# Altium schematic sheet main.SchDoc
size A4; SheetNumber: 1; SheetTotal: 1
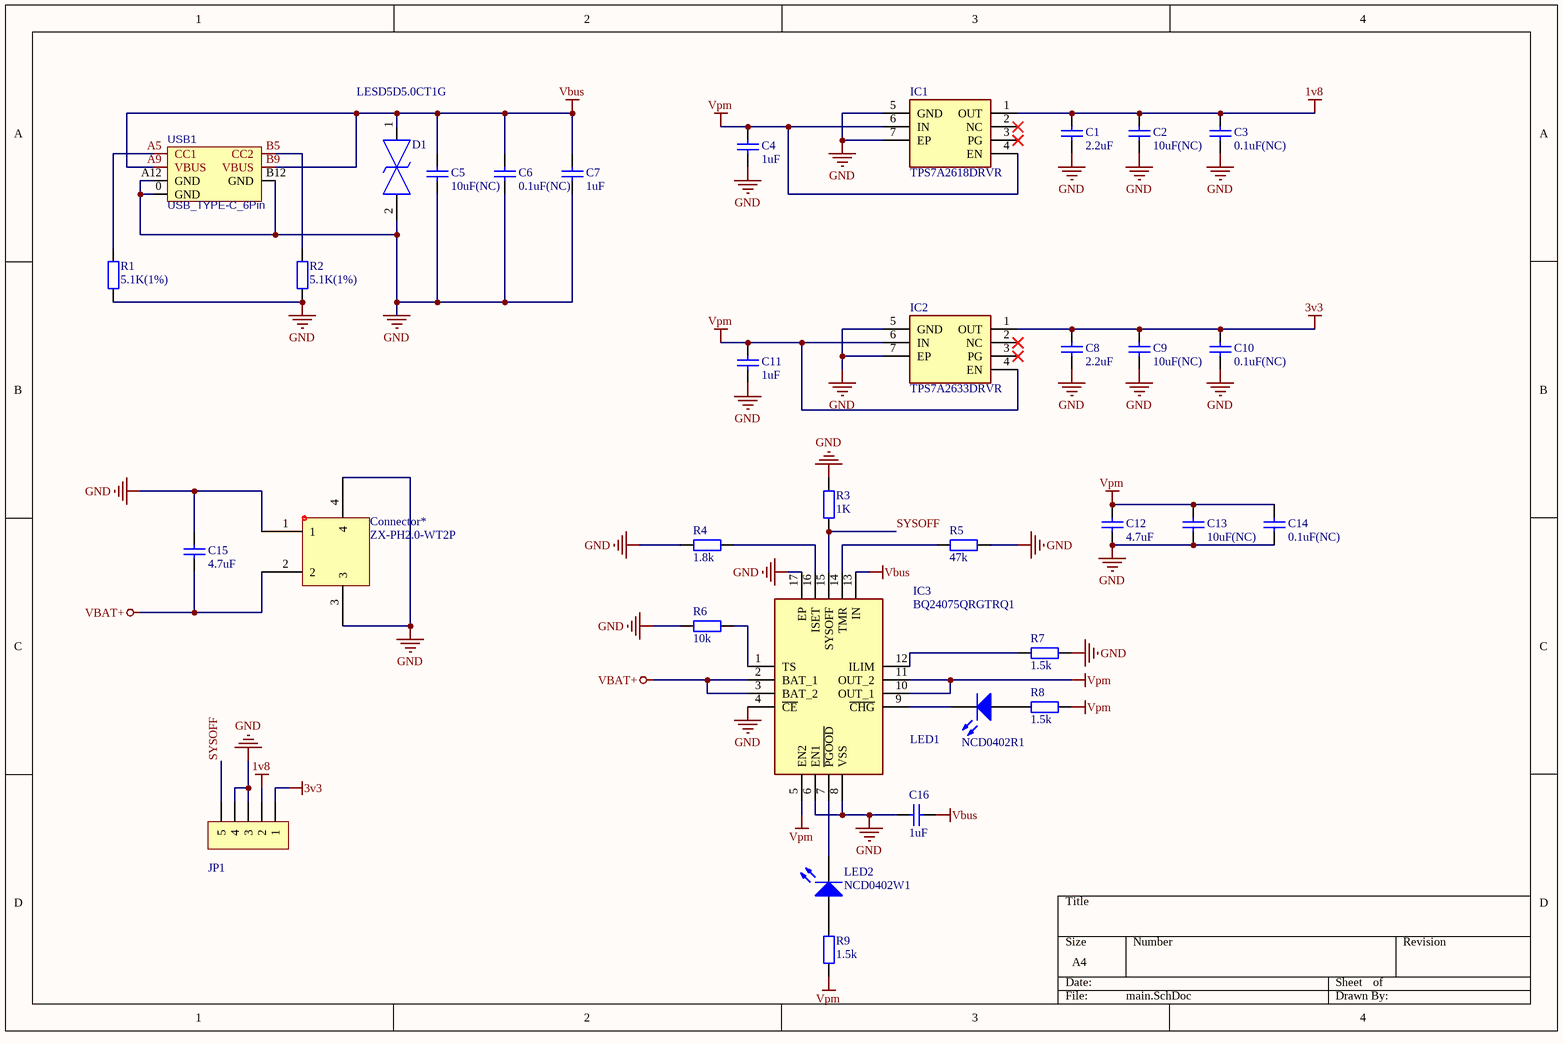
[diagram p0: main.SchDoc]

## Parts
C1  2.2uF  [C0402_L]
C2  10uF(NC)  [C0402_L]
C3  0.1uF(NC)  [C0402_L]
C4  1uF  [C0402_L]
C5  10uF(NC)  [C0402_L]
C6  0.1uF(NC)  [C0402_L]
C7  1uF  [C0402_L]
C8  2.2uF  [C0402_L]
C9  10uF(NC)  [C0402_L]
C10  0.1uF(NC)  [C0402_L]
C11  1uF  [C0402_L]
C12  4.7uF  [C0402_L]
C13  10uF(NC)  [C0402_L]
C14  0.1uF(NC)  [C0402_L]
C15  4.7uF  [C0402_L]
C16  1uF  [C0402_L]
Connector*  ZX-PH2.0-WT2P  [ZX-PH2.0-WT2P]
D1  LESD5D5.0CT1G  [LESD5D50CT1G]
IC1  TPS7A2618DRVR  [TPS7A2633DRVR]
IC2  TPS7A2633DRVR  [TPS7A2633DRVR]
IC3  BQ24075QRGTRQ1  [QFN50P300X300X100-17N-D]
JP1  HDR-1X5  [HDR2.54-LI-5P]  (value not drawn)
LED1  NCD0402R1  [LED0402_R]
LED2  NCD0402W1  [LED0402_W]
R1  5.1K(1%)  [R0402_L]
R2  5.1K(1%)  [R0402_L]
R3  1K  [R0402_L]
R4  1.8k  [R0402_L]
R5  47k  [R0402_L]
R6  10k  [R0402_L]
R7  1.5k  [R0402_L]
R8  1.5k  [R0402_L]
R9  1.5k  [R0402_L]
USB1  USB_TYPE-C_6Pin  [USB-C-SMD_6P]

## Nets
1v8: C1.1 C2.1 C3.1 IC1.1(OUT) JP1.2
3v3: C8.1 C9.1 C10.1 IC2.1(OUT) JP1.1
GND: C1.2 C2.2 C3.2 C4.2 C5.2 C6.1 C7.2 C8.2 C9.2 C10.2 C11.2 C12.2 C13.2 C14.2 C15.1 C16.2 Connector*.1 Connector*.3 Connector*.4 D1.2 IC1.5(GND) IC1.7(EP) IC2.5(GND) IC2.7(EP) IC3.4(~{CE}) IC3.6(EN1) IC3.8(VSS) IC3.17(EP) JP1.3 JP1.4 R1.1 R2.1 R3.1 R4.2 R5.1 R6.2 R7.1 USB1.0(GND) USB1.A12(GND) USB1.B12(GND)
VBAT+: C15.2 Connector*.2 IC3.2(BAT_1) IC3.3(BAT_2)
Vbus: C5.1 C6.2 C7.1 C16.1 D1.1 IC3.13(IN) USB1.A9(VBUS) USB1.B9(VBUS)
Vpm: C4.1 C11.1 C12.1 C13.1 C14.1 IC1.4(EN) IC1.6(IN) IC2.4(EN) IC2.6(IN) IC3.5(EN2) IC3.10(OUT_1) IC3.11(OUT_2) R8.1 R9.1
SYSOFF: IC3.15(SYSOFF) JP1.5 R3.2
NetIC3_1: IC3.1(TS) R6.1
NetIC3_7: IC3.7(~{PGOOD}) LED2.2(K)
NetIC3_9: IC3.9(~{CHG}) LED1.2(K)
NetIC3_12: IC3.12(ILIM) R7.2
NetIC3_14: IC3.14(TMR) R5.2
NetIC3_16: IC3.16(ISET) R4.1
NetLED1_1: LED1.1(A) R8.2
NetLED2_1: LED2.1(A) R9.2
NetR1_2: R1.2 USB1.A5(CC1)
NetR2_2: R2.2 USB1.B5(CC2)

Not connected (* = marked no-connect by the designer): IC1 2(NC)* 3(PG)*; IC2 2(NC)* 3(PG)*

## Library data of the parts
C1-C16 = C: 贴片电容/MLCC电容; BOM名称: 无极性贴片电容; 联系下单店铺卖家 免费帮你查找封装: 联系下单店铺卖家 免费技术指导; 当前库版本V2024.2.3 @淘宝卖家:黄晶宝石: 最新版本发布https://item.taobao.com/item.htm?id=566775463719
Connector* = ZX-PH2.0-WT2P: https://jlcpcb.com/partdetail/Megastar-ZX_PH2_0WT2P/C7429689
D1 = LESD5D5.0CT1G: TVS Diode (Bi-directional); Manufacturer_Name: LRC; Height: 0.7mm; Manufacturer_Part_Number: LESD5D5.0CT1G
IC1 IC2 = TPS7A2633DRVR: Integrated Circuit; Manufacturer_Name: Texas Instruments; Datasheet Link: https://www.ti.com/lit/gpn/TPS7A26; Height: 0.8mm; Manufacturer_Part_Number: TPS7A2633DRVR; Mouser Part Number: 595-TPS7A2633DRVR; Mouser Price/Stock: https://www.mouser.co.uk/ProductDetail/Texas-Instruments/TPS7A2633DRVR?qs=OTrKUuiFdkZcobdYhR7qbQ%3D%3D; Arrow Part Number: TPS7A2633DRVR; Arrow Price/Stock: null?utm_currency=USD&region=nac
IC3 = BQ24075QRGTRQ1: Integrated Circuit; Manufacturer_Name: Texas Instruments; Datasheet Link: http://www.ti.com/lit/gpn/bq24075-q1; Height: 1mm; Manufacturer_Part_Number: BQ24075QRGTRQ1; Mouser Part Number: 595-BQ24075QRGTRQ1; Mouser Price/Stock: https://www.mouser.co.uk/ProductDetail/Texas-Instruments/BQ24075QRGTRQ1?qs=i8JZjLRTtkLLeOPMlhTMpg%3D%3D; Arrow Part Number: BQ24075QRGTRQ1; Arrow Price/Stock: null?region=nac
JP1 = Header 5: 5P接插件; 联系卖家，免费查找封装: 唯一出售店铺网址https://shop463601444.taobao.com; 封装库来自淘宝卖家ID：黄晶宝石: 其他店铺购入均为盗版封装库，请立即申请退款，本店现金奖励50~200元; BOM名称: 5P接插件
LED1 LED2 = LED: BOM名称: 贴片LED; 封装库来自淘宝卖家：黄晶宝石: 其他店铺购入均为盗版封装库，无更新权益，请立即申请退款，本店现金奖励200~1000元
R1-R3 R6 R8 R9 = R: 贴片电阻; 联系下单店铺卖家 免费帮你查找封装: 联系下单店铺卖家 免费技术指导; BOM名称: 贴片电阻
R4 = R: RISET = 890 AΩ / 0.5A = 1.8k; BOM名称: 贴片电阻; 联系下单店铺卖家 免费帮你查找封装: 联系下单店铺卖家 免费技术指导
R5 = R: K_TMR ≈48s/kΩ / tMAXCHG / (10 × KTMR ) / (6.25 hr × 3600 s/hr) / (10 × 48 s/kΩ) = 46.8 kΩ / 6h is 45k; BOM名称: 贴片电阻; 联系下单店铺卖家 免费帮你查找封装: 联系下单店铺卖家 免费技术指导
R7 = R: 1.5k 1A limitation of input / RISET = 1550 AΩ / 1 A = 1.5k; BOM名称: 贴片电阻; 联系下单店铺卖家 免费帮你查找封装: 联系下单店铺卖家 免费技术指导
USB1 = USB_TYPE-C_6Pin: USB_TYPE-C_6Pin母座; 联系下单店铺卖家 免费技术支持: 联系下单店铺卖家 免费帮你查找封装; 当前库版本V2024.2.3 @淘宝卖家:黄晶宝石: 最新版本发布https://item.taobao.com/item.htm?id=566775463719